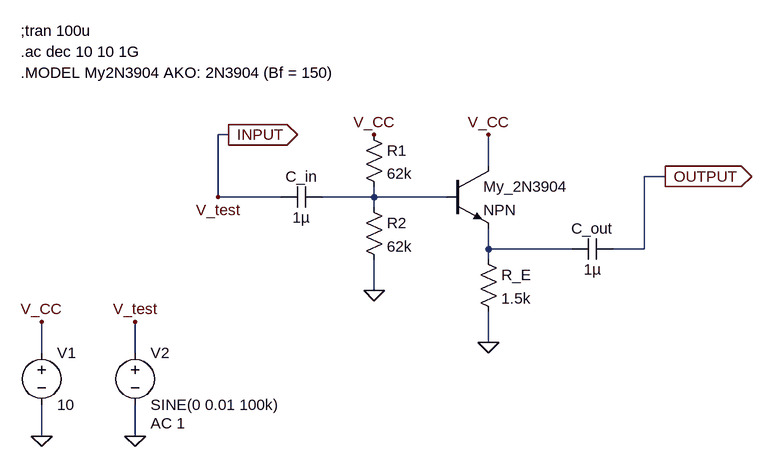
[diagram p0: schematic S1_NPN_EF.asc]
S1_NPN_EF.asc, the LTspice schematic file:
Version 4
SHEET 1 988 680
WIRE -64 32 -80 32
WIRE 336 80 336 32
WIRE 608 96 576 96
WIRE -80 128 -80 32
WIRE 16 128 -80 128
WIRE 160 128 160 112
WIRE 160 128 80 128
WIRE 272 128 160 128
WIRE 160 144 160 128
WIRE 336 208 336 176
WIRE 464 208 336 208
WIRE 576 208 576 96
WIRE 576 208 528 208
WIRE 336 224 336 208
WIRE 160 272 160 224
WIRE 336 352 336 304
WIRE -352 368 -352 320
WIRE -208 368 -208 320
WIRE -352 496 -352 448
WIRE -208 496 -208 448
FLAG -352 496 0
FLAG -208 496 0
FLAG -352 320 V_CC
FLAG 336 352 0
FLAG 160 272 0
FLAG 336 32 V_CC
FLAG -208 320 V_test
FLAG 160 32 V_CC
FLAG -64 32 INPUT
IOPIN -64 32 Out
FLAG 608 96 OUTPUT
IOPIN 608 96 Out
FLAG -80 128 V_test
SYMBOL npn 272 80 R0
SYMATTR InstName My_2N3904
SYMBOL voltage -352 352 R0
WINDOW 123 0 0 Left 0
WINDOW 39 0 0 Left 0
SYMATTR InstName V1
SYMATTR Value 10
SYMBOL voltage -208 352 R0
WINDOW 123 24 124 Left 2
WINDOW 39 0 0 Left 0
SYMATTR Value2 AC 1
SYMATTR InstName V2
SYMATTR Value SINE(0 0.01 100k)
SYMBOL res 144 16 R0
SYMATTR InstName R1
SYMATTR Value 62k
SYMBOL res 144 128 R0
SYMATTR InstName R2
SYMATTR Value 62k
SYMBOL res 320 208 R0
SYMATTR InstName R_E
SYMATTR Value 1.5k
SYMBOL cap 80 112 R90
WINDOW 0 0 32 VBottom 2
WINDOW 3 32 32 VTop 2
SYMATTR InstName C_in
SYMATTR Value 1µ
SYMBOL cap 528 192 R90
WINDOW 0 0 32 VBottom 2
WINDOW 3 32 32 VTop 2
SYMATTR InstName C_out
SYMATTR Value 1µ
TEXT -384 -64 Left 2 !.MODEL My2N3904 AKO: 2N3904 (Bf = 150)
TEXT -384 -96 Left 2 !.ac dec 10 10 1G
TEXT -384 -128 Left 2 !;tran 100u

The netlist it stands for:
* S1_NPN_EF.asc
Q§My_2N3904 V_CC N001 N002 0 NPN
V1 V_CC 0 10
V2 INPUT 0 SINE(0 0.01 100k) AC 1
R1 V_CC N001 62k
R2 N001 0 62k
R_E N002 0 1.5k
C_in N001 INPUT 1µ
C_out OUTPUT N002 1µ
.model NPN NPN
.model PNP PNP
.lib standard.bjt
.MODEL My2N3904 AKO: 2N3904 (Bf = 150)
.ac dec 10 10 1G
;tran 100u
.backanno
.end